# EAGLE design ap3036b-boost-driver-mk-1.0 (EAGLE 7.5.0)
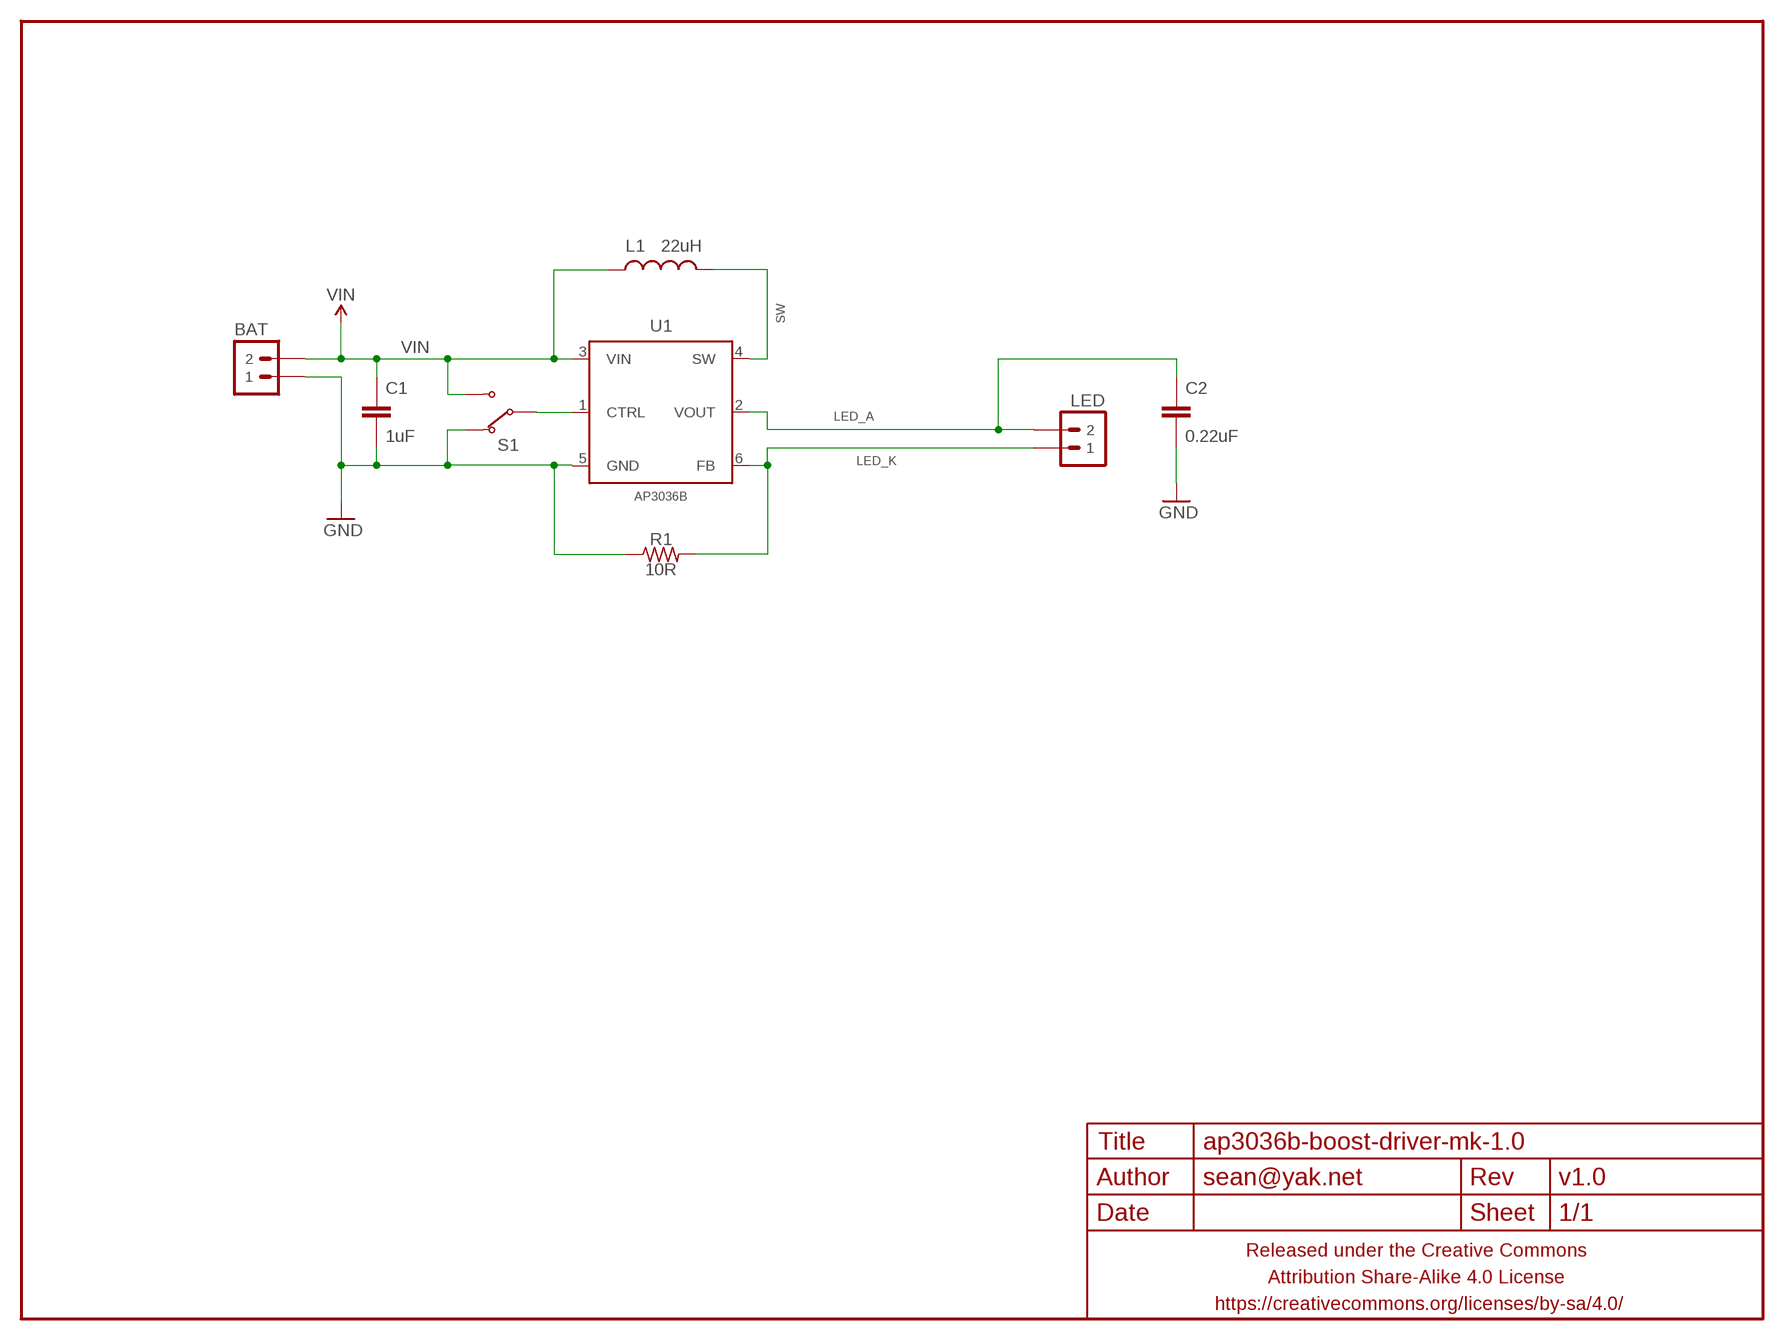
[diagram p0: schematic, sheet 1]

## Parts
BAT  M02PTH-CENTERED  [1X02-CENTER]
C1  1uF  CAPACITOR-CERAMICC0603-TIGHTER  [C0603-TIGHTER]
C2  0.22uF  CAPACITOR-CERAMICC0603-TIGHTER  [C0603-TIGHTER]
FRAME1  FRAME-LETTERNO_PACKAGE  [DUMMY]
L1  22uH  INDUCTOR0603-TIGHTER  [L0603]
LED  M02PTH-CENTERED  [1X02-CENTER]
R1  10R  RESISTORR0603-TIGHTER  [R0603-TIGHTER]
S1  SWITCH-SPDTJS102011SAQN  [SWITCH-SPDT-SMD-RA-JS102011SAQN]
U1  AP3036B  [SOT26]

## Nets
GND: BAT.1 C1.2 C2.2 R1.1 S1.3(NC) U1.5(GND)
LED_A: C2.1 LED.2 U1.2(VOUT)
LED_K: LED.1 R1.2 U1.6(FB)
N$2: S1.2(COM) U1.1(CTRL)
SW: L1.2 U1.4(SW)
VIN: BAT.2 C1.1 L1.1 S1.1(NO) U1.3(VIN)

## Library data of the parts
BAT LED = a_parts:M02: Standard 2-pin 0.1" header. Use with - straight break away headers ( PRT-00116) - right angle break away headers (PRT-00553) - swiss pins (PRT-00743) - machine pins (PRT-00117) - female headers (PRT-00115) Molex polarized connector foot print use with: PRT-08233 with associated crimp pins and housings. 2.54_SCREWTERM for use with PRT-10571. 3.5mm Screw Terminal footprints for PRT-08084 5mm Screw Terminal footprints for use with PRT-08433
C1 C2 = a_parts:CAPACITOR-CERAMIC: CAPACITOR, European symbol
FRAME1 = a_parts:FRAME-LETTER: Schematic Frame Standard 8.5x11 US Letter frame; DESIGNER: sean@yak.net; VERSION: v1.0
L1 = a_parts:INDUCTOR: Inductors Basic Inductor/Choke - 0603 and 1206. Footprints are not proven and vary greatly between part numbers. SRN6045- 33uH, 20% 1.4A SDR0403-560KL - 56uH, 10%, 500mA RMS/740mA peak
R1 = a_parts:RESISTOR: RESISTOR, American symbol
S1 = a_parts:SWITCH-SPDT
U1 = a_parts:AP3036B

## Board
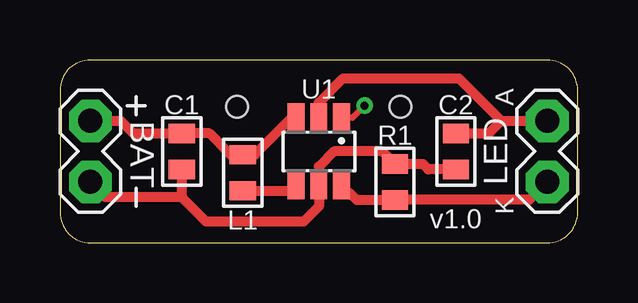
[diagram p1: board, top side]
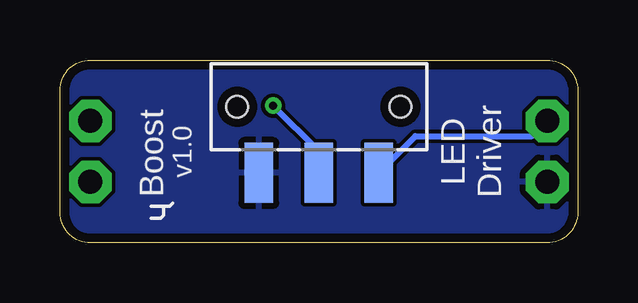
[diagram p2: board, bottom side, seen from below]

Size 21.59 x 7.62 mm. Coordinates in mm from the lower left corner, seen from the top.
Outline: 0,6.35 0,1.27 arc90 1.27,0 20.32,0 arc90 21.59,1.27 21.59,6.35 arc90 20.32,7.62 1.27,7.62 arc90 0,6.35
Copper layers (1*16): Top 0.0356mm / dielectric 1.5011mm / Bottom 0.0356mm
Design rules "LaenPCBOrder2": minimum track width 6mil, minimum drill 13mil, track to track 6mil, track to pad 6mil, pad to pad 6mil, via to via 6mil, smd to smd 6mil, copper to edge 15mil, drill to drill 6mil, minimum pad ring 7mil, minimum via ring 7mil, stop-mask expansion 3mil, vias tented up to drill 20mil, thermal gap 10mil

### Footprints (pad centres in the part's own frame; a part is rotated, then mirrored left to right if it is on the bottom)
1X02-CENTER = drill 1 pad 1.778 octagon: 1 -1.27,0; 2 1.27,0
C0603-TIGHTER = smd 0.8 x 1.1: 1 -0.75,0; 2 0.75,0
L0603 = smd 0.8 x 1.1: 1 -0.75,0; 2 0.75,0
R0603-TIGHTER = smd 0.8 x 1.1: 1 -0.75,0; 2 0.75,0
SWITCH-SPDT-SMD-RA-JS102011SAQN = smd 1.2 x 2.5: 1 -2.5,0; 2 0,0; 3 2.5,0 | hole 0.9: -3.4,-2.75; 3.4,-2.75
SOT26 = smd 0.7 x 1.2: 1 -0.95,-1.4; 2 0,-1.4; 3 0.95,-1.4; 4 0.95,1.4; 5 0,1.4; 6 -0.95,1.4

### Placement (x,y rotation side)
BAT  1.27,3.81 90 top
C1  5.08,3.81 270 top
C2  16.51,3.81 270 top
FRAME1  0,0 0 top
L1  7.62,2.92 270 top
LED  20.32,3.81 90 top
R1  13.97,2.54 270 top
S1  10.79,2.92 180 bottom
U1  10.79,3.81 180 top

### Tracks (layer width: path | path; a pad name or v marks a point on that pad's centre or on a via)
GND
  Top 0.406: 5.08,1.91 1.91,1.91 BAT.1 | C1.2 5.08,1.91 | 5.08,1.91 6.1,0.89 10.16,0.89 10.79,1.52 U1.5 10.79,3.17 11.43,3.81 13.45,3.81 R1.1 15.12,3.29 15.36,3.06 C2.2
  pour Bottom (isolate 0.152, rank 6): 1.27,7.62 20.32,7.62 arc-90 21.59,6.35 21.59,1.27 arc-90 20.32,0 1.27,0 arc-90 0,1.27 0,6.35 arc-90
LED_A
  Top 0.406: U1.2 10.79,5.84 11.81,6.86 16.64,6.86 18.41,5.08 | 18.41,5.08 LED.2 | C2.1 17.89,4.56 18.41,5.08
LED_K
  Top 0.406: LED.1 19.57,1.79 R1.2 12.37,1.79 U1.6
N$2  (via drill 0.33)
  Top 0.254: v12.7,5.71 12.19,5.21 U1.1
  Bottom 0.254: S1.2 10.79,3.81 v12.7,5.71
SW
  Top 0.406: L1.2 9.61,2.17 U1.4
VIN
  Top 0.406: BAT.2 2.54,5.08 3.06,4.56 C1.1 6.24,4.56 7.12,3.67 L1.1 8.12,3.67 9.65,5.21 U1.3
  Bottom 0.254: S1.1 6.77,4.45 1.91,4.45 BAT.2

### Text on the board
tPlace: A | K
bPlace: LED / Driver | Boost